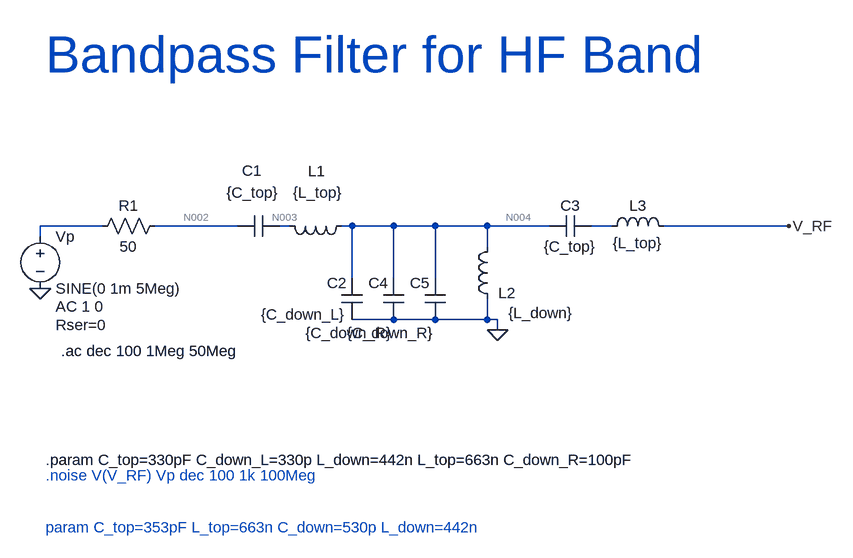
[diagram p0: schematic Antenna_BP_Filter.asc]
Antenna_BP_Filter.asc, the LTspice schematic file:
Version 4.1
SHEET 1 924 680
WIRE -208 48 -304 48
WIRE 0 48 -128 48
WIRE 80 48 64 48
WIRE 176 48 160 48
WIRE 240 48 176 48
WIRE 304 48 240 48
WIRE 384 48 304 48
WIRE 480 48 384 48
WIRE 576 48 544 48
WIRE 848 48 656 48
WIRE -304 64 -304 48
WIRE 384 80 384 48
WIRE 176 128 176 48
WIRE 240 128 240 48
WIRE 304 128 304 48
WIRE 240 192 176 192
WIRE 304 192 240 192
WIRE 384 192 384 160
WIRE 384 192 304 192
WIRE 400 192 384 192
WIRE 400 208 400 192
FLAG 400 208 0
FLAG 848 48 V_RF
FLAG -304 144 0
SYMBOL voltage -304 48 R0
WINDOW 123 24 124 Left 2
WINDOW 39 24 152 Left 2
SYMATTR Value2 AC 1 0
SYMATTR SpiceLine Rser=0
SYMATTR InstName Vp
SYMATTR Value SINE(0 1m 5Meg)
SYMBOL res -112 32 R90
WINDOW 0 0 56 VBottom 2
WINDOW 3 32 56 VTop 2
SYMATTR InstName R1
SYMATTR Value 50
SYMBOL cap 64 32 R90
WINDOW 0 -54 42 VBottom 2
WINDOW 3 -51 41 VTop 2
SYMATTR InstName C1
SYMATTR Value {C_top}
SYMBOL cap 192 192 R180
WINDOW 0 24 56 Left 2
WINDOW 3 24 8 Left 2
SYMATTR InstName C2
SYMATTR Value {C_down_L}
SYMBOL cap 480 64 R270
WINDOW 0 32 32 VTop 2
WINDOW 3 0 32 VBottom 2
SYMATTR InstName C3
SYMATTR Value {C_top}
SYMBOL ind 176 32 R90
WINDOW 0 -53 54 VBottom 2
WINDOW 3 -51 52 VTop 2
SYMATTR InstName L1
SYMATTR Value {L_top}
SYMBOL ind 400 176 R180
WINDOW 0 -28 25 Left 2
WINDOW 3 -118 -6 Left 2
SYMATTR InstName L2
SYMATTR Value {L_down}
SYMBOL ind 560 64 R270
WINDOW 0 32 56 VTop 2
WINDOW 3 5 56 VBottom 2
SYMATTR InstName L3
SYMATTR Value {L_top}
SYMBOL cap 256 192 R180
WINDOW 0 24 56 Left 2
WINDOW 3 16 -21 Left 2
SYMATTR InstName C4
SYMATTR Value {C_down_R}
SYMBOL cap 320 192 R180
WINDOW 0 24 56 Left 2
WINDOW 3 16 -21 Left 2
SYMATTR InstName C5
SYMATTR Value {C_down_R}
TEXT -272 240 Left 2 !.ac dec 100 1Meg 50Meg
TEXT -296 432 Left 2 ;.noise V(V_RF) Vp dec 100 1k 100Meg
TEXT -296 408 Left 2 !.param C_top=330pF C_down_L=330p L_down=442n L_top=663n C_down_R=100pF
TEXT -296 -216 Left 6 ;Bandpass Filter for HF Band
TEXT -296 512 Left 2 ;param C_top=353pF L_top=663n C_down=530p L_down=442n

The netlist it stands for:
* Antenna_BP_Filter.asc
Vp N001 0 SINE(0 1m 5Meg) AC 1 0 Rser=0
R1 N002 N001 50
C1 N003 N002 {C_top}
C2 0 N004 {C_down_L}
C3 N004 N005 {C_top}
L1 N004 N003 {L_top}
L2 0 N004 {L_down}
L3 N005 V_RF {L_top}
C4 0 N004 {C_down_R}
C5 0 N004 {C_down_R}
.ac dec 100 1Meg 50Meg
* .noise V(V_RF) Vp dec 100 1k 100Meg
.param C_top=330pF C_down_L=330p L_down=442n L_top=663n C_down_R=100pF
* Bandpass Filter for HF Band
* param C_top=353pF L_top=663n C_down=530p L_down=442n
.backanno
.end

* Results of the author's LTspice run, read from the files saved beside the schematic
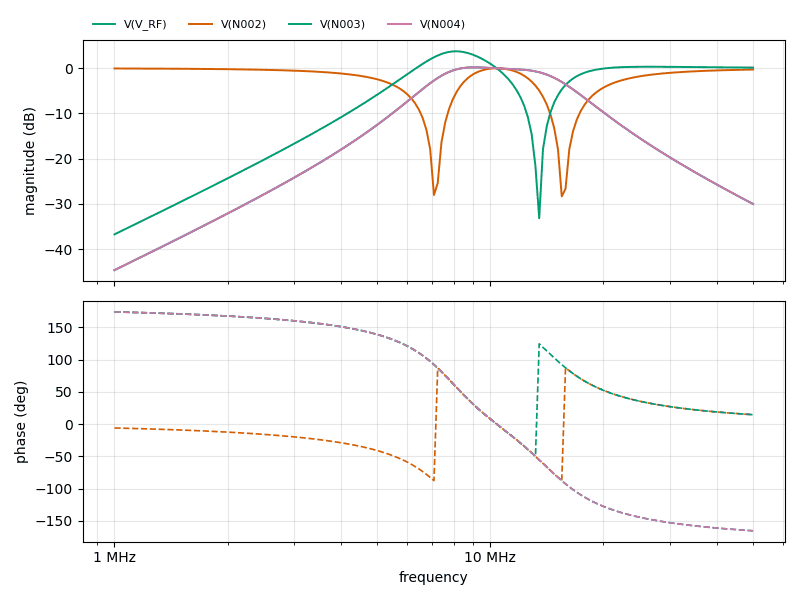
[diagram p1: AC Analysis of Antenna_BP_Filter.asc, plotted from the saved traces]
* AC Analysis, 1 run:
*   V(V_RF): -44.63 dB at 1 MHz, -30.01 dB at 50 MHz, peak 0.20 dB at 9.12 MHz, 3 dB below the peak at 7.051 MHz and 15.32 MHz
*   V(N002): -0.05 dB at 1 MHz, -0.28 dB at 50 MHz, peak -0.00 dB at 10.47 MHz, 3 dB below the peak at 8.504 MHz and 12.9 MHz
*   V(N003): -36.72 dB at 1 MHz, 0.14 dB at 50 MHz, peak 3.75 dB at 8.128 MHz, 3 dB below the peak at 6.542 MHz and 10.11 MHz
*   V(N004): -44.63 dB at 1 MHz, -30.01 dB at 50 MHz, peak 0.20 dB at 9.12 MHz, 3 dB below the peak at 7.051 MHz and 15.32 MHz